# EAGLE schematic probes_breakout_box_make-before-break (EAGLE 9.5.2)
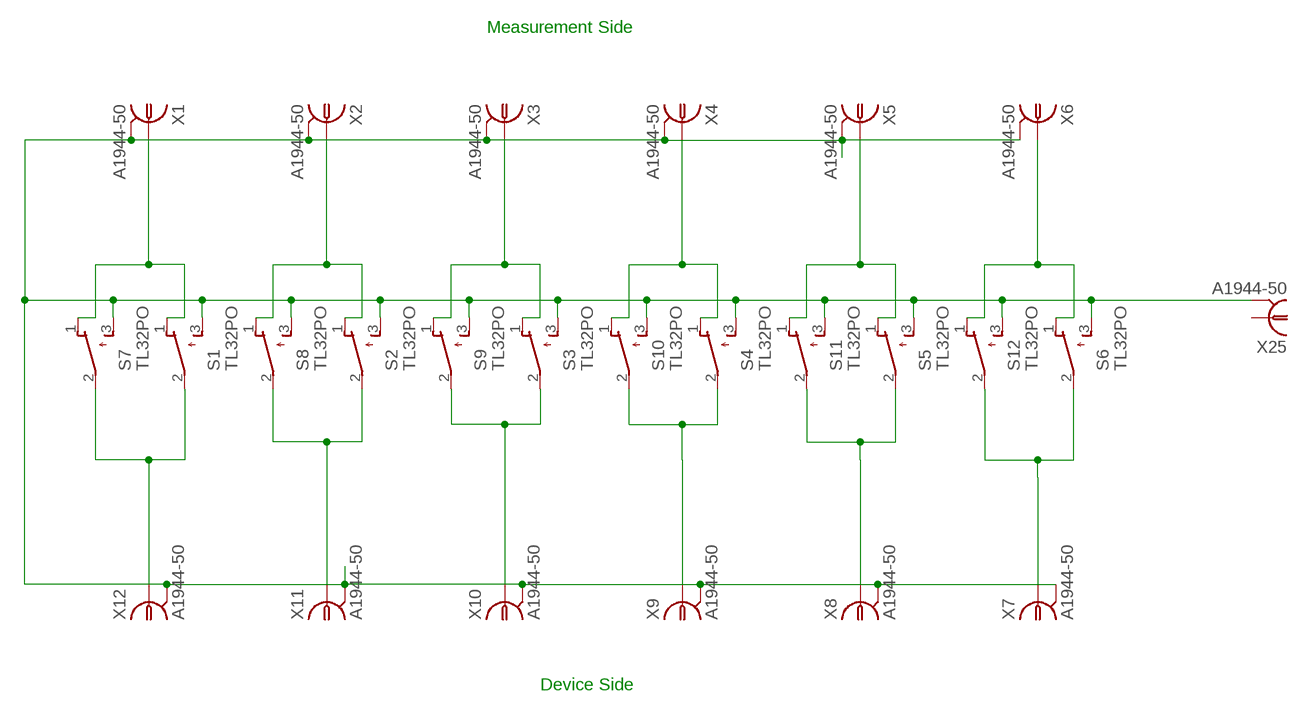
[diagram p0: schematic, sheet 1]

## Parts
S1  TL32PO  [TL3XPO]
S2  TL32PO  [TL3XPO]
S3  TL32PO  [TL3XPO]
S4  TL32PO  [TL3XPO]
S5  TL32PO  [TL3XPO]
S6  TL32PO  [TL3XPO]
S7  TL32PO  [TL3XPO]
S8  TL32PO  [TL3XPO]
S9  TL32PO  [TL3XPO]
S10  TL32PO  [TL3XPO]
S11  TL32PO  [TL3XPO]
S12  TL32PO  [TL3XPO]
X1  A1944-50  [A1944]
X2  A1944-50  [A1944]
X3  A1944-50  [A1944]
X4  A1944-50  [A1944]
X5  A1944-50  [A1944]
X6  A1944-50  [A1944]
X7  A1944-50  [A1944]
X8  A1944-50  [A1944]
X9  A1944-50  [A1944]
X10  A1944-50  [A1944]
X11  A1944-50  [A1944]
X12  A1944-50  [A1944]
X25  A1944-50  [A1944]

## Nets
N$1: S6.2(P) S12.2(P) X7.1
N$2: S1.3(S) S2.3(S) S3.3(S) S4.3(S) S5.3(S) S6.3(S) S7.3(S) S8.3(S) S9.3(S) S10.3(S) S11.3(S) S12.3(S) X1.2 X1.3 X1.4 X1.5 X2.2 X2.3 X2.4 X2.5 X3.2 X3.3 X3.4 X3.5 X4.2 X4.3 X4.4 X4.5 X5.2 X5.3 X5.4 X5.5 X6.2 X6.3 X6.4 X6.5 X7.2 X7.3 X7.4 X7.5 X8.2 X8.3 X8.4 X8.5 X9.2 X9.3 X9.4 X9.5 X10.2 X10.3 X10.4 X10.5 X11.2 X11.3 X11.4 X11.5 X12.2 X12.3 X12.4 X12.5 X25.2 X25.3 X25.4 X25.5
N$3: S5.2(P) S11.2(P) X8.1
N$4: S4.2(P) S10.2(P) X9.1
N$5: S3.2(P) S9.2(P) X10.1
N$6: S2.2(P) S8.2(P) X11.1
N$19: S1.2(P) S7.2(P) X12.1
N$21: S1.1(O) S7.1(O) X1.1
N$22: S2.1(O) S8.1(O) X2.1
N$23: S3.1(O) S9.1(O) X3.1
N$24: S4.1(O) S10.1(O) X4.1
N$25: S5.1(O) S11.1(O) X5.1
N$33: S6.1(O) S12.1(O) X6.1
Unconnected: X25.1

## Notes on the sheet
- Measurement Side
- Device Side

## Library data of the parts
S1-S12 = switch:TL32PO: TINY SWITCH ON - MOM Source: http://www2.produktinfo.conrad.com/datenblaetter/700000-724999/705152-da-01-de-Subminiaturschalter_TL_36YO.pdf
X1-X12 X25 = con-coax:A1944-50: BNC CONNECTOR 50 Ohm distributor Buerklin 78F2475; OC_FARNELL: unknown; OC_NEWARK: unknown